# EAGLE design AddonBoard (EAGLE 5.11)
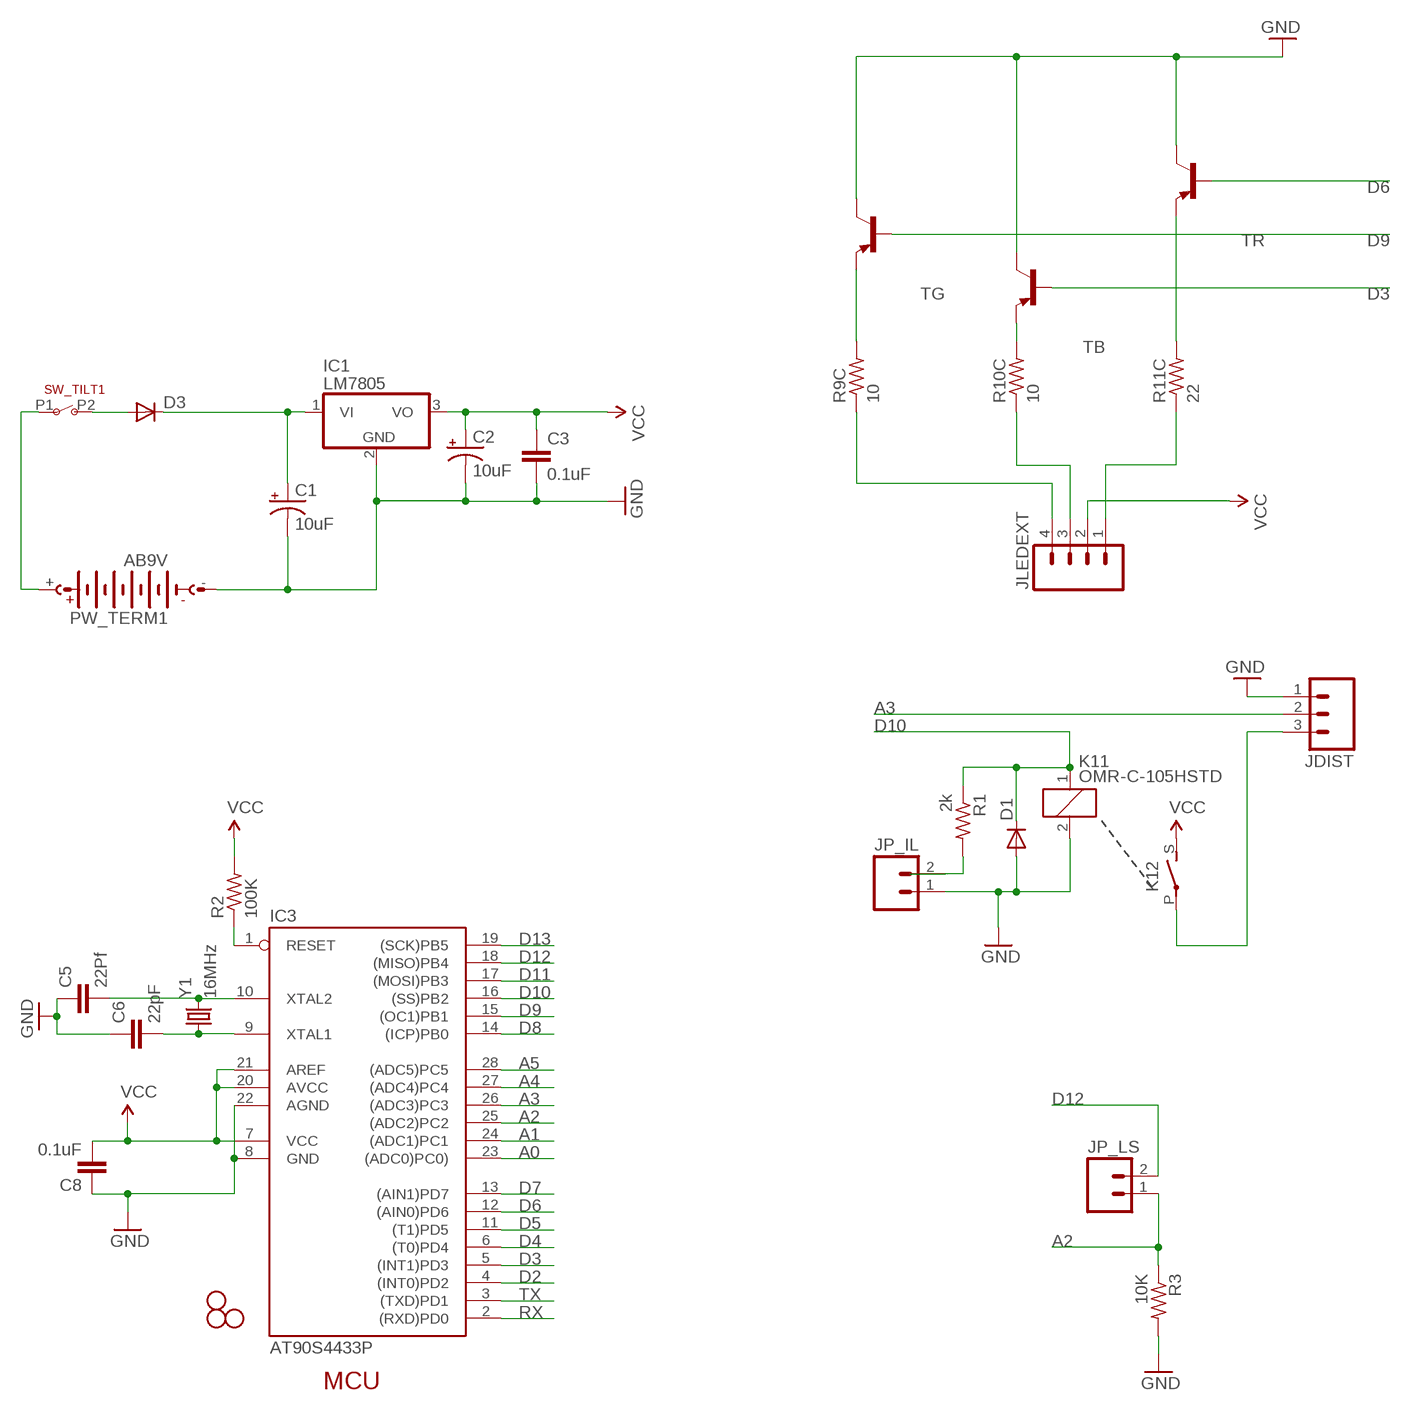
[diagram p0: schematic, sheet 1]

## Parts
C1  10uF  CAP_POLPTH2  [CPOL-RADIAL-10UF-25V]
C2  10uF  CAP_POLPTH2  [CPOL-RADIAL-10UF-25V]
C3  0.1uF  CAPPTH  [CAP-PTH-SMALL]
C5  22Pf  CAPPTH  [CAP-PTH-SMALL]
C6  22pF  CAPPTH  [CAP-PTH-SMALL]
C8  0.1uF  CAPPTH  [CAP-PTH-SMALL]
D1  DIODE1N4148  [DIODE-1N4148]
D3  DIODE1N4148  [DIODE-1N4148]
IC1  LM7805  7805T  [TO220H]
IC3  AT90S4433P  [DIL28-3]
JDIST  M03POLAR_LOCK  [MOLEX-1X3_LOCK]
JLEDEXT  M04POLAR  [MOLEX-1X4]
JP5  STAND-OFF  [STAND-OFF]
JP7  STAND-OFF  [STAND-OFF]
JP9  STAND-OFF  [STAND-OFF]
JP_IL  M02POLAR_LOCK  [MOLEX-1X2_LOCK]
JP_LS  M02POLAR_LOCK  [MOLEX-1X2_LOCK]
K1  OMR-C-105HSTD  [OMR-C-105H]
PW_TERM1  AB9V  [AB9V]
R1  2k  R-US_0207/2V  [0207/2V]
R2  100K  R-US_0207/2V  [0207/2V]
R3  10K  R-US_0207/2V  [0207/2V]
R9C  10  R-US_0207/2V  [0207/2V]
R10C  10  R-US_0207/2V  [0207/2V]
R11C  22  R-US_0207/2V  [0207/2V]
SW_TILT1  SWITCH-SPST-TILTV0  [SWITCH-SPST-TILT]
TB  2N3906-PNP-TO92-EBC  [TO92-EBC]
TG  2N3906-PNP-TO92-EBC  [TO92-EBC]
TR  2N3906-PNP-TO92-EBC  [TO92-EBC]
Y1  16MHz  CRYSTALHC49US  [HC49US]

## Nets
A0: IC3.23((ADC0)PC0))
A1: IC3.24((ADC1)PC1)
A2: IC3.25((ADC2)PC2) JP_LS.1 R3.1
A3: IC3.26((ADC3)PC3) JDIST.2
A4: IC3.27((ADC4)PC4)
A5: IC3.28((ADC5)PC5)
D2: IC3.4((INT0)PD2)
D3: IC3.5((INT1)PD3) TB.B
D4: IC3.6((T0)PD4)
D5: IC3.11((T1)PD5)
D6: IC3.12((AIN0)PD6) TR.B
D7: IC3.13((AIN1)PD7)
D8: IC3.14((ICP)PB0)
D9: IC3.15((OC1)PB1) TG.B
D10: D1.C IC3.16((SS)PB2) K1.1 R1.1
D11: IC3.17((MOSI)PB3)
D12: IC3.18((MISO)PB4) JP_LS.2
D13: IC3.19((SCK)PB5)
GND: C1.2(-) C2.2(-) C3.2 C5.1 C6.1 C8.1 D1.A IC1.2(GND) IC3.8(GND) IC3.22(AGND) JDIST.1 JP_IL.1 K1.2 PW_TERM1.- R3.2 TB.C TG.C TR.C
LEDB: JLEDEXT.3 R10C.1
LEDG: JLEDEXT.4 R9C.1
LEDR: JLEDEXT.1 R11C.1
N$3: D3.A SW_TILT1.P2
N$4: JP_IL.2 R1.2
N$5: R9C.2 TG.E
N$8: IC3.1(RESET) R2.1
N$14: R11C.2 TR.E
N$15: R10C.2 TB.E
N$19: C1.1(+) D3.C IC1.1(VI)
N$20: JDIST.3 K1.P(2:P)
N$22: PW_TERM1.+ SW_TILT1.P1
RX: IC3.2((RXD)PD0)
TX: IC3.3((TXD)PD1)
VCC: C2.1(+) C3.1 C8.2 IC1.3(VO) IC3.7(VCC) IC3.20(AVCC) IC3.21(AREF) JLEDEXT.2 K1.S(2:S) R2.2
XTAL1: C6.2 IC3.9(XTAL1) Y1.1
XTAL2: C5.2 IC3.10(XTAL2) Y1.2

## Notes on the sheet
- MCU

## Library data of the parts
C1 C2 = SparkFun:CAP_POL: Capacitor Polarized These are standard SMD and PTH capacitors. Normally 10uF, 47uF, and 100uF in electrolytic and tantalum varieties. Always verify the external diameter of the through hole cap, it varies with capacity, voltage, and manufacturer. The EIA devices should be standard.
C3 C5 C6 C8 = SparkFun:CAP: Capacitor Standard 0603 ceramic capacitor, and 0.1" leaded capacitor.
D1 D3 = SparkFun:DIODE: Diode These are standard reverse protection diodes and small signal diodes. SMA package can handle up to about 1A. SOD-323 can handle about 200mA. What the SOD-323 package when ordering, there are some mfgs out there that are 5-pin packages.
IC1 = linear:78*: Positive VOLTAGE REGULATOR Source: http://cache.national.com/ds/LM/LM78L05.pdf http://www.fairchildsemi.com/ds/LM/LM7805.pdf
IC3 = atmel:AT90S4433: MICROCONTROLLER 4 Kbytes FLASH 128 bytes SRAM 256 bytes EEPROM UART 6-channel 10 bit ADC; OC_FARNELL: unknown; OC_NEWARK: unknown
JDIST = SparkFun:M03: Header 3 Standard 3-pin 0.1" header. Use with straight break away headers (SKU : PRT-00116), right angle break away headers (PRT-00553), swiss pins (PRT-00743), machine pins (PRT-00117), and female headers (PRT-00115). Molex polarized connector foot print use with SKU : PRT-08232 with associated crimp pins and housings.
JLEDEXT = SparkFun:M04: Header 4 Standard 4-pin 0.1" header. Use with straight break away headers (SKU : PRT-00116), right angle break away headers (PRT-00553), swiss pins (PRT-00743), machine pins (PRT-00117), and female headers (PRT-00115). Molex polarized connector foot print use with SKU : PRT-08231 with associated crimp pins and housings.
JP5 JP7 JP9 = SparkFun:STAND-OFF: Stand Off This is the mechanical footprint for a #4 phillips button head screw. Use the keepout ring to avoid running the screw head into surrounding components. SKU : PRT-00447
JP_IL JP_LS = SparkFun:M02: Header 2 Standard 2-pin 0.1" header. Use with straight break away headers (SKU : PRT-00116), right angle break away headers (PRT-00553), swiss pins (PRT-00743), machine pins (PRT-00117), and female headers (PRT-00115). Molex polarized connector foot print use with SKU : PRT-08233 with associated crimp pins and housings.
K1 = Declan:OMR-C-105H: RELAY reed, 1 x norm. open, Tyco Electronics; OC_FARNELL: unknown; OC_NEWARK: unknown
PW_TERM1 = battery:AB9V: 9-V BATTERY CLIP
R1-R3 R9C R10C R11C = adafruit:R-US_: RESISTOR, American symbol
SW_TILT1 = Declan:SWITCH-SPST-TILT
TB TG TR = transistor-neu-to92:*-PNP-: PNP Transistror
Y1 = SparkFun:CRYSTAL: Crystals Various standard crystals. Proven footprints. Spark Fun Electronics SKU : COM-00534

## Net classes
1 power: width 0.813 mm, clearance 0.508 mm

## Board
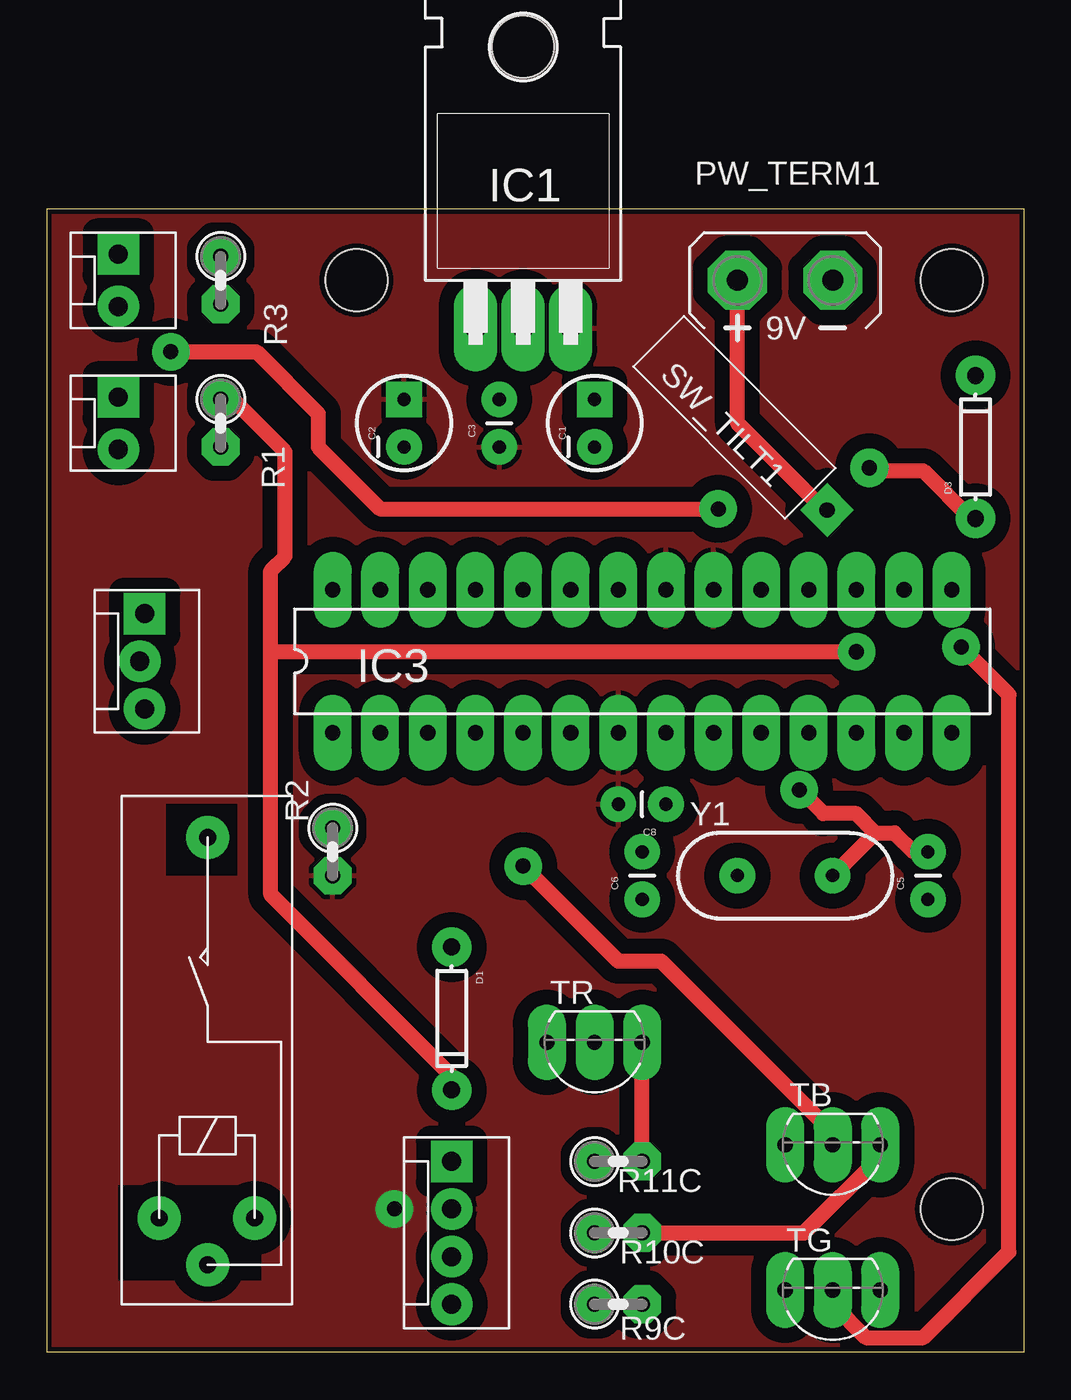
[diagram p1: board, top side]
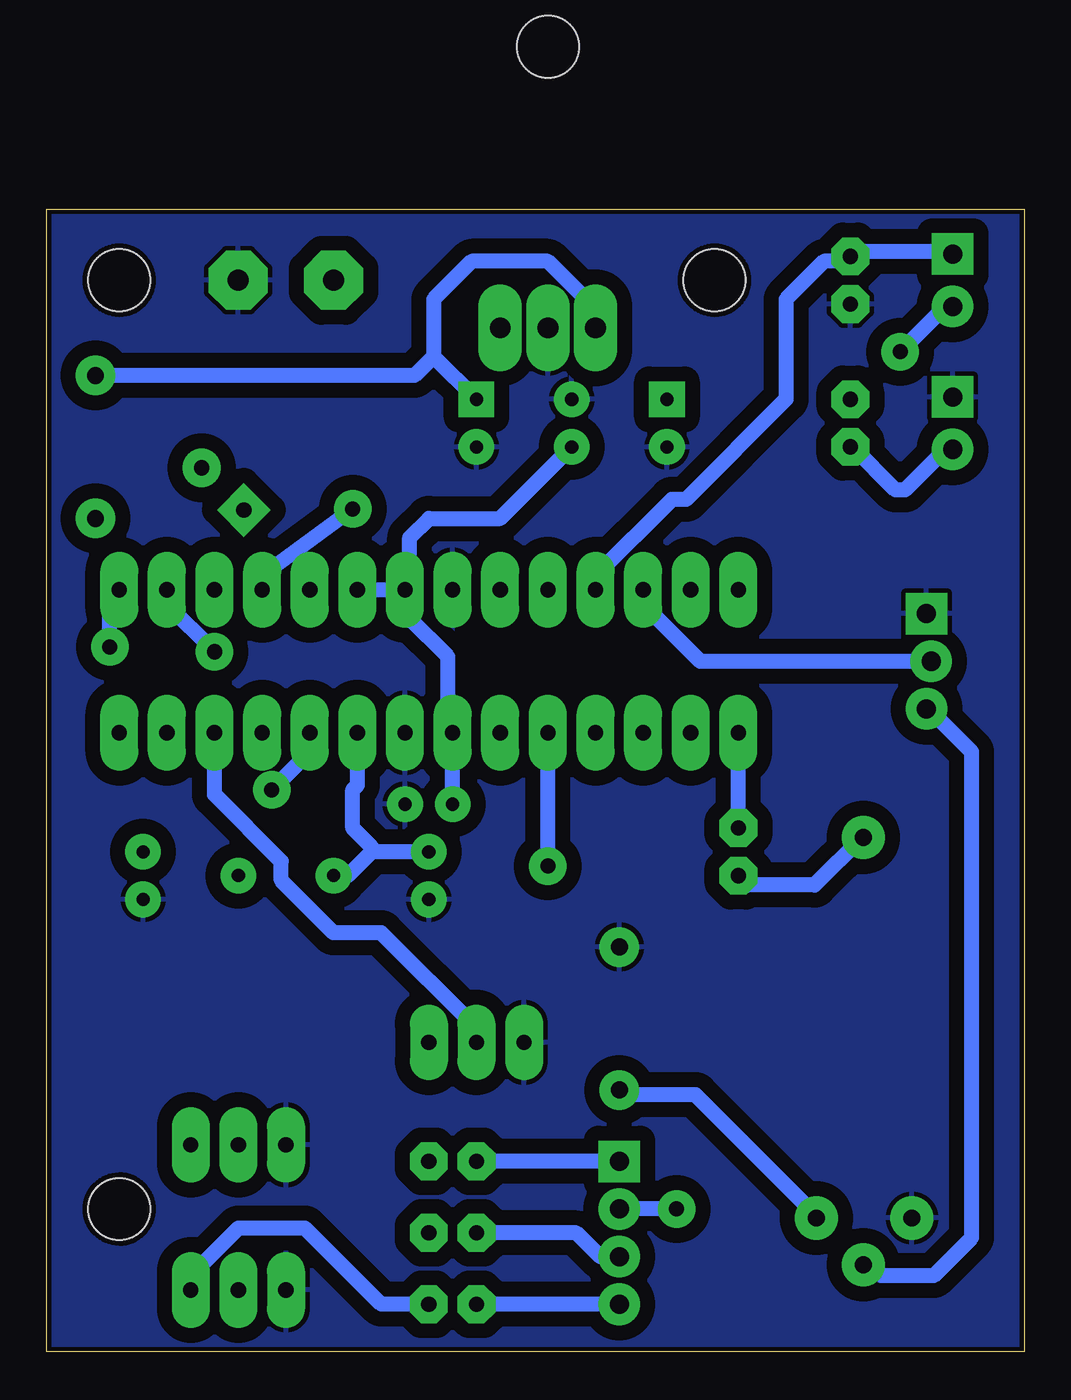
[diagram p2: board, bottom side, seen from below]

Size 52.12 x 60.95 mm. Coordinates in mm from the lower left corner, seen from the top.
Outline: 0,0 52.12,0 52.12,60.95 0,60.95 0,0
Copper layers (1*16): Top 0.035mm / dielectric 1.5mm / Bottom 0.035mm
Design rules "hobby": minimum track width 0.8mm, minimum drill 0.8mm, track to track 0.8mm, track to pad 0.8mm, pad to pad 0.45mm, via to via 0.8mm, smd to smd 8mil, copper to edge 10mil, drill to drill 8mil, minimum pad ring 0.6mm, minimum via ring 0.6mm, stop-mask expansion 4mil, vias tented up to drill 25mil, thermal gap 10mil
tRestrict: area 14,31.7 to 49.5,34.3; area 14,39.4 to 49.5,41.9; area 3.8,3.8 to 11.4,8.9; area 6.3,25.4 to 10.2,29.2; area 2.5,54.6 to 5.1,59.7; area 2.5,47 to 5.1,52.1; area 3.8,33 to 6.3,40.6; area 20.3,1.3 to 22.9,11.4

### Footprints (pad centres in the part's own frame; a part is rotated, then mirrored left to right if it is on the bottom)
CPOL-RADIAL-10UF-25V = drill 0.7 pad 1.651 square: 1 1.27,0 | drill 0.7 pad 1.651 round: 2 -1.27,0
CAP-PTH-SMALL = drill 0.7 pad 1.651 round: 1 0,0; 2 2.54,0
DIODE-1N4148 = drill 0.9 pad 1.88 round: A -3.81,0; C 3.81,0
TO220H = drill 1.118 long: 1 -2.54,-10.16; 2 0,-10.16; 3 2.54,-10.16 | hole 3.302: 0,4.826
DIL28-3 = drill 0.813 long: 1 -16.51,-3.81; 2 -13.97,-3.81; 3 -11.43,-3.81; 4 -8.89,-3.81; 5 -6.35,-3.81; 6 -3.81,-3.81; 7 -1.27,-3.81; 8 1.27,-3.81; 9 3.81,-3.81; 10 6.35,-3.81; 11 8.89,-3.81; 12 11.43,-3.81; 13 13.97,-3.81; 14 16.51,-3.81; 15 16.51,3.81; 16 13.97,3.81; 17 11.43,3.81; 18 8.89,3.81; 19 6.35,3.81; 20 3.81,3.81; 21 1.27,3.81; 22 -1.27,3.81; 23 -3.81,3.81; 24 -6.35,3.81; 25 -8.89,3.81; 26 -11.43,3.81; 27 -13.97,3.81; 28 -16.51,3.81
MOLEX-1X3_LOCK = drill 1.016 pad 1.88 square: 1 0,0.127 | drill 1.016 pad 1.88 round: 2 2.54,-0.127; 3 5.08,0.127
MOLEX-1X4 = drill 1.016 pad 1.88 square: 1 0,0 | drill 1.016 pad 1.88 round: 2 2.54,0; 3 5.08,0; 4 7.62,0
STAND-OFF = hole 3.302: 0,0
MOLEX-1X2_LOCK = drill 1.016 pad 1.88 square: 1 -0.127,0 | drill 1.016 pad 1.88 round: 2 2.667,0
OMR-C-105H = drill 0.9 pad 2.3 round: 1 4.6,2; 2 4.6,7.1; P 2.1,4.5; S 24.9,4.5
AB9V = drill 1.118 pad 3.15 octagon: + 0,2.54; - 0,-2.54
0207/2V = drill 0.813 pad 1.676 octagon: 1 -1.27,0; 2 1.27,0
SWITCH-SPST-TILT = drill 0.813 pad 2.032 square: P1 1.905,-1.27 | drill 0.813 pad 2.032 round: P2 5.08,-1.27
TO92-EBC = drill 0.813 long: B 0,-1.27; C 2.54,-1.27; E -2.54,-1.27
HC49US = drill 0.7 pad 1.651 round: 1 -2.54,0; 2 2.54,0

### Placement (x,y rotation side)
C1  29.21,49.53 90 top
C2  19.05,49.53 90 top
C3  24.13,48.26 90 top
C5  46.99,24.13 90 top
C6  31.75,24.13 90 top
C8  33.02,29.21 180 top
D1  21.59,17.78 270 top
D3  49.53,48.26 90 top
IC1  25.4,64.77 0 top
IC3  31.75,36.83 0 top
JDIST  5.08,39.37 270 top
JLEDEXT  21.59,10.16 270 top
JP5  48.26,57.15 0 top
JP7  16.51,57.15 0 top
JP9  48.26,7.62 0 top
JP_IL  3.81,50.8 270 top
JP_LS  3.81,58.42 270 top
K1  13.08,2.54 90 top
PW_TERM1  39.37,57.15 90 top
R1  9.27,49.53 270 top
R2  15.24,26.67 270 top
R3  9.27,57.15 270 top
R9C  30.48,2.54 0 top
R10C  30.48,6.35 0 top
R11C  30.48,10.16 0 top
SW_TILT1  39.37,44.45 45 top
TB  41.91,9.78 180 top
TG  41.91,2.03 180 top
TR  29.21,15.24 180 top
Y1  39.37,25.4 0 top

### Tracks (layer width: path | path; a pad name or v marks a point on that pad's centre or on a via)
A2
  Bottom 0.8: IC3.25 22.86,41.4 18.8,45.47 18.03,45.47 12.7,50.8 12.7,56.13 10.67,58.17 9.65,58.17 9.4,58.42 R3.1 9.14,58.67 3.81,58.67 JP_LS.1
A3
  Bottom 0.8: IC3.26 20.32,39.88 17.27,36.83 JDIST.2
D3  (via drill 0.8)
  Top 0.8: v25.4,25.91 30.48,20.83 32.77,20.83 41.91,11.68 TB.B
  Bottom 0.8: v25.4,25.91 IC3.5
D6
  Bottom 0.8: TR.B 29.21,17.27 34.29,22.35 36.83,22.35 39.62,25.15 39.62,26.16 43.18,29.72 IC3.12
D9  (via drill 0.8)
  Top 0.8: TG.B 41.91,2.54 43.69,0.76 46.74,0.76 51.31,5.33 51.31,35.05 v48.77,37.59
  Bottom 0.8: v48.77,37.59 48.77,40.13 IC3.15
D10  (via drill 0.8)
  Top 0.8: 11.94,37.34 11.94,24.38 21.59,14.73 D1.C | 11.94,37.34 11.94,41.66 12.7,42.42 12.7,48.01 9.91,50.8 R1.1 | 11.94,37.34 v43.18,37.34
  Bottom 0.8: IC3.16 45.72,39.88 v43.18,37.34 | D1.C 21.34,13.72 17.53,13.72 11.18,7.37 K1.1
D12  (via drill 0.8)
  Top 0.8: v35.81,44.96 17.78,44.96 14.48,48.26 14.48,50.04 11.18,53.34 v6.6,53.34
  Bottom 0.8: IC3.18 40.64,41.4 v35.81,44.96 | v6.6,53.34 4.32,55.63 3.81,55.63 JP_LS.2
GND
  pour Bottom: -1.27,62.23 53.34,62.23 53.34,-1.27 -1.27,-1.27
LEDB
  Bottom 0.8: R10C.1 23.88,6.35 22.61,5.08 JLEDEXT.3
LEDG
  Bottom 0.8: JLEDEXT.4 R9C.1
LEDR
  Bottom 0.8: JLEDEXT.1 R11C.1
N$3
  Top 0.8: D3.A 49.28,44.45 46.74,46.99 43.94,46.99 SW_TILT1.P2
N$4
  Bottom 0.8: R1.2 9.14,48.26 6.86,45.97 6.35,45.97 4.32,48.01 3.81,48.01 JP_IL.2
N$5
  Bottom 0.8: R9C.2 34.29,2.54 38.35,6.6 41.91,6.6 44.45,4.06 TG.E
N$8
  Bottom 0.8: R2.1 IC3.1
N$14
  Top 0.8: R11C.2 TR.E
N$15
  Top 0.8: R10C.2 40.39,6.35 44.45,10.41 TB.E
N$19
  Bottom 0.8: 31.5,53.09 C1.1 | 31.5,53.09 31.5,56.13 29.46,58.17 25.4,58.17 22.86,55.63 IC1.1 | D3.C 32.51,52.07 31.5,53.09
N$20
  Bottom 0.8: JDIST.3 5.08,34.29 2.79,32 2.79,6.1 4.83,4.06 7.62,4.06 8.38,4.83 K1.P
N$22
  Top 0.8: PW_TERM1.+ 36.83,49.53 41.4,44.96 SW_TILT1.P1
VCC  (via drill 0.8)
  Bottom 0.8: C8.2 IC3.7 30.73,33.27 30.73,37.08 32.77,39.12 32.77,40.39 | IC3.20 IC3.21 32.77,40.39 | v18.54,7.62 JLEDEXT.2 | R2.2 14.73,24.89 11.18,24.89 8.64,27.43 K1.S | 32.77,40.39 32.77,43.43 31.75,44.45 27.94,44.45 C3.1
  pour Top: -1.27,62.23 54.61,62.23 54.61,-1.27 -1.27,-1.27
XTAL1
  Bottom 0.8: C6.2 34.8,26.67 | 34.8,26.67 36.07,25.4 Y1.1 | IC3.9 35.56,30.23 35.81,29.97 35.81,27.94 34.8,26.92 34.8,26.67
XTAL2  (via drill 0.8)
  Top 0.8: Y1.2 44.2,27.69 | 44.2,27.69 45.21,27.69 46.23,26.67 C5.2 | v40.13,29.97 41.4,28.7 43.18,28.7 44.2,27.69
  Bottom 0.8: IC3.10 38.1,32 v40.13,29.97

### Text on the board
tDocu: V S G | G B V R